# EAGLE design uc_ctrl (EAGLE 6.5.0)
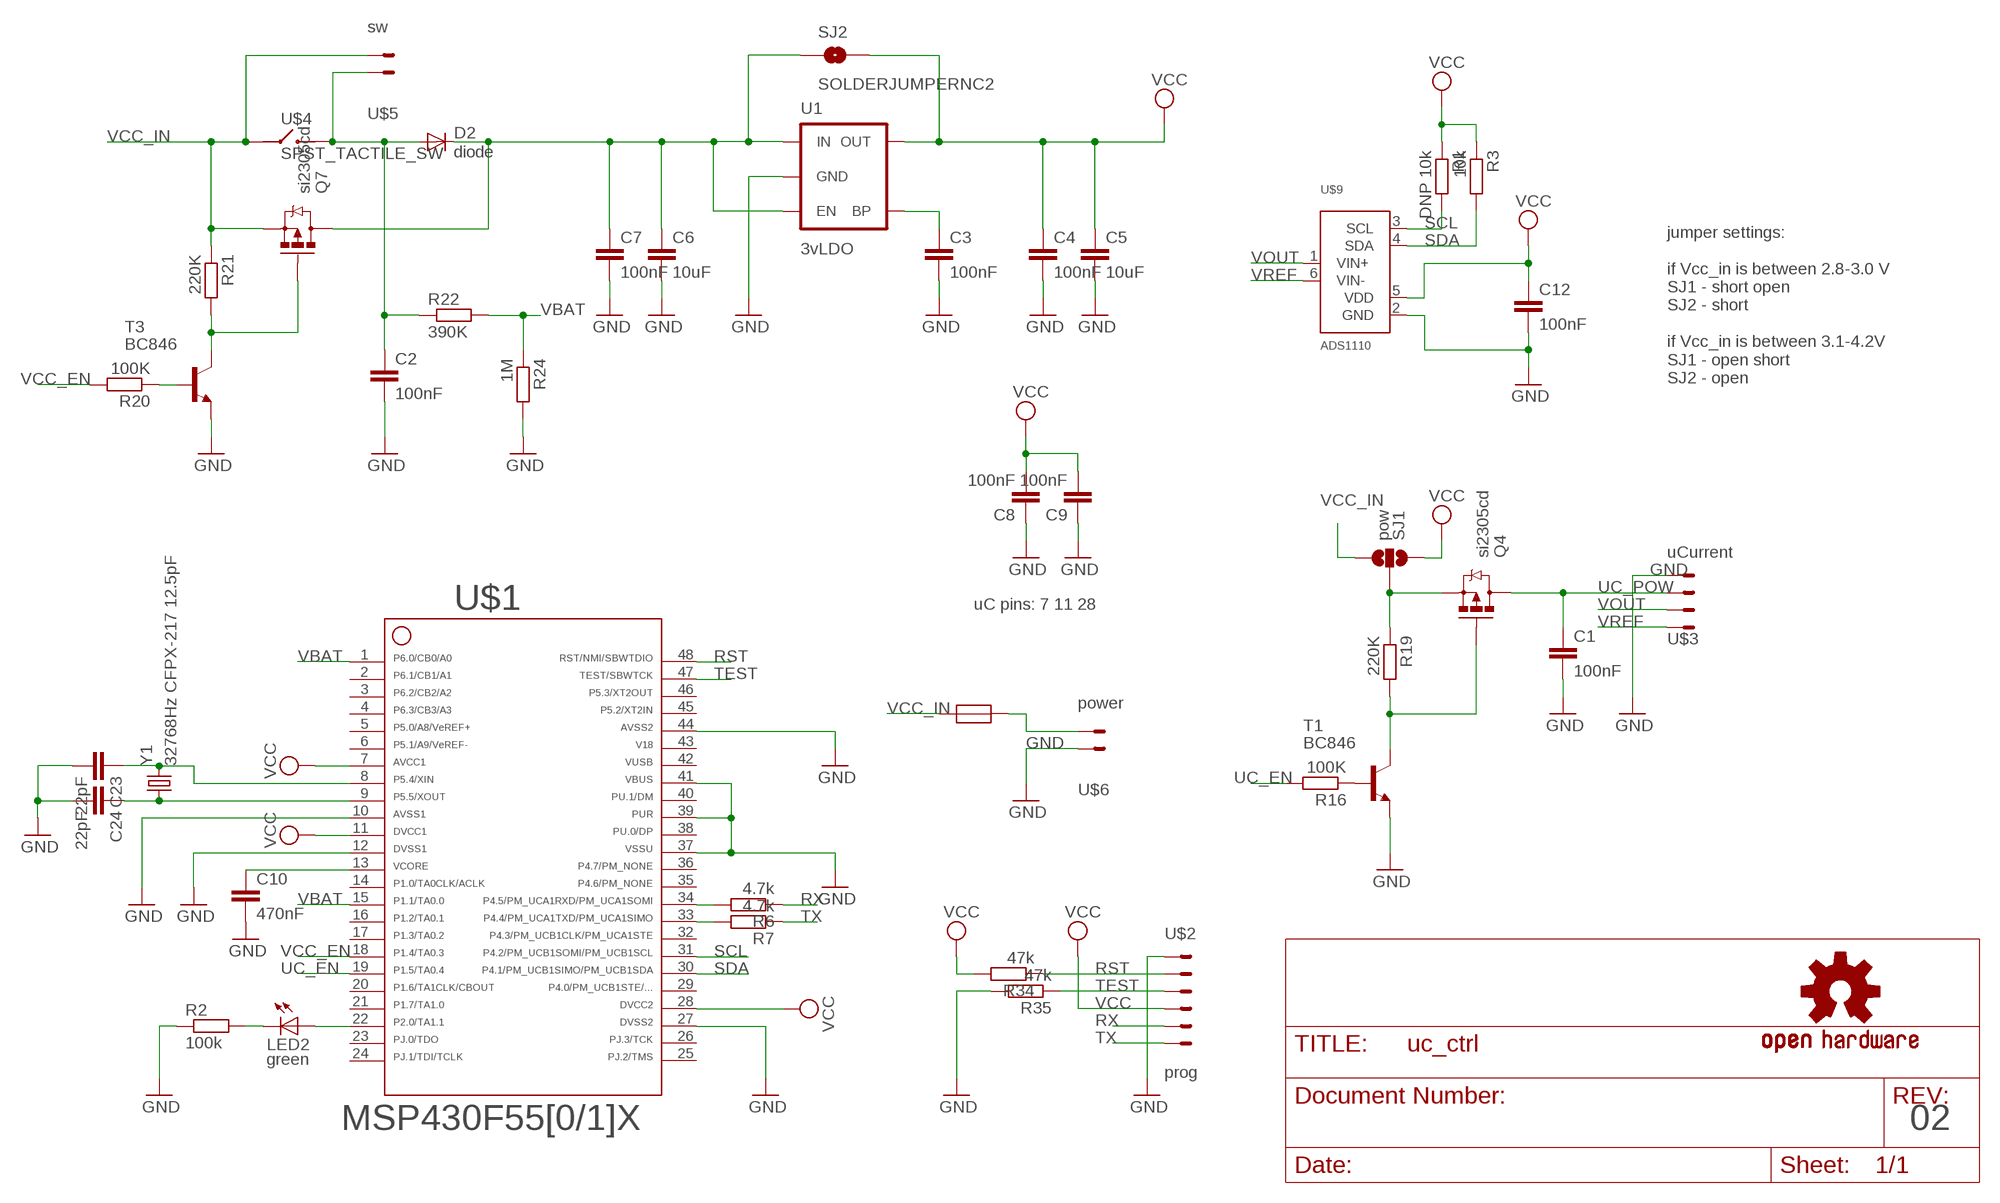
[diagram p0: schematic, sheet 1]

## Parts
C1  100nF  C-EUC0805  [C0805]
C2  100nF  C-EUC0805  [C0805]
C3  100nF  C-EUC0805  [C0805]
C4  100nF  C-EUC0805  [C0805]
C5  10uF  C-EUC0805  [C0805]
C6  10uF  C-EUC0805  [C0805]
C7  100nF  C-EUC0805  [C0805]
C8  100nF  C-EUC0805  [C0805]
C9  100nF  C-EUC0805  [C0805]
C10  470nF  C-EUC0805  [C0805]
C12  100nF  C-EUC0805  [C0805]
C23  22pF  C-EUC0805  [C0805]
C24  22pF  C-EUC0805  [C0805]
D2  diode  DIODESMA  [SMA-DIODE]
LED2  green  LEDCHIPLED_0805  [CHIPLED_0805]
Q4  si2305cd  MOSFET-PCHANNELSMD_POWER  [SOT23-3_POWER]
Q7  si2305cd  MOSFET-PCHANNELSMD_POWER  [SOT23-3_POWER]
R1  DNP 10k  R-EU_R0805W  [R0805W]
R2  100k  R-EU_R0805W  [R0805W]
R3  10k  R-EU_R0805W  [R0805W]
R6  4.7k  R-EU_R0805W  [R0805W]
R7  4.7k  R-EU_R0805W  [R0805W]
R16  100K  R-EU_R0805W  [R0805W]
R19  220K  R-EU_R0805W  [R0805W]
R20  100K  R-EU_R0805W  [R0805W]
R21  220K  R-EU_R0805W  [R0805W]
R22  390K  R-EU_R0805W  [R0805W]
R24  1M  R-EU_R0805W  [R0805W]
R34  47k  R-EU_R0805W  [R0805W]
R35  47k  R-EU_R0805W  [R0805W]
SJ1  pow  SOLDERJUMPER_2WAYPASTE1&2  [SJ_3_PASTE1&2]
SJ2  SOLDERJUMPERNC2  [SJ_2S-NOTRACE]
T1  BC846  [SOT23]
T3  BC846  [SOT23]
U1  3vLDO  V_REG_LDOSMD  [SOT23-5]
U$1  F55[0/1]X---PT48  [PT48]
U$2  prog  MOLEX_6HORIZONTAL  [0530480610]
U$3  uCurrent  MOLEX_4HORIZONTAL  [0530480401]
U$4  SPST_TACTILE_SW  [6X3.5_TACTILE_SW]
U$5  sw  MOLEX_2HORIZONTAL  [0530480210]
U$6  power  MOLEX_2HORIZONTAL  [0530480210]
U$7  OSHW-LOGOM  [OSHW-LOGO-M]
U$8  RESETTABLE  [1210]
U$9  ADS1110  [SOT23-6]
Y1  32768Hz CFPX-217 12.5pF  CRYSTAL3.2X1.5  [CRYSTAL-SMD-3.2X1.5]

## Nets
GND: C1.2 C2.2 C3.2 C4.2 C5.2 C6.2 C7.2 C8.1 C9.1 C10.2 C12.2 C23.2 C24.2 R2.1 R24.2 R35.2 T1.2(E) T3.2(E) U1.2(GND) U$1.10 U$1.12 U$1.27 U$1.37 U$1.39 U$1.41 U$1.44 U$2.1 U$3.1 U$6.P$1 U$9.2(GND)
N$1: LED2.C R2.2
N$2: LED2.A U$1.22
N$3: R16.1 T1.1(B)
N$4: C6.1 C7.1 D2.C Q7.3(D) SJ2.1 U1.1(IN) U1.3(EN)
N$5: C3.1 U1.4(BP)
N$6: C10.1 U$1.13
N$8: Q4.2(S) R19.1 SJ1.2
N$9: U$6.P$2 U$8.P$2
N$11: R6.2 U$1.34
N$13: R7.2 U$1.33
N$25: C24.1 U$1.9 Y1.P$1
N$26: C23.1 U$1.8 Y1.P$2
N$28: Q4.1(G) R19.2 T1.3(C)
N$31: R20.1 T3.1(B)
N$32: Q7.1(G) R21.2 T3.3(C)
PUSH: C2.1 D2.A R22.1 U$4.2 U$5.P$1
RST: R34.1 U$1.48 U$2.2
RX: R6.1 U$2.5
SCL: R1.2 U$1.31 U$9.3(SCL)
SDA: R3.2 U$1.30 U$9.4(SDA)
TEST: R35.1 U$1.47 U$2.3
TX: R7.1 U$2.6
UC_EN: R16.2 U$1.19
UC_POW: C1.1 Q4.3(D) U$3.2
VBAT: R22.2 R24.1 U$1.1 U$1.15
VCC: C4.1 C5.1 C8.2 C9.2 C12.1 R1.1 R3.1 R34.2 SJ1.1 SJ2.2 U1.5(OUT) U$1.7 U$1.11 U$1.28 U$2.4 U$9.5(VDD)
VCC_EN: R20.2 U$1.18
VCC_IN: Q7.2(S) R21.1 SJ1.3 U$4.1 U$5.P$2 U$8.P$1
VOUT: U$3.3 U$9.1(VIN+)
VREF: U$3.4 U$9.6(VIN-)
Unconnected: U$1.2 U$1.3 U$1.4 U$1.5 U$1.6 U$1.14 U$1.16 U$1.17 U$1.20 U$1.21 U$1.23 U$1.24 U$1.25 U$1.26 U$1.29 U$1.32 U$1.35 U$1.36 U$1.38 U$1.40 U$1.45

## Notes on the sheet
- jumper settings:
  
  if Vcc_in is between 2.8-3.0 V
  SJ1 - short open
  SJ2 - short
  
  if Vcc_in is between 3.1-4.2V
  SJ1 - open short
  SJ2 - open
- uC pins: 7 11 28
- 02

## Power pins joined to a net without a drawn wire
42: U$1.42
43: U$1.43
46: U$1.46

## Library data of the parts
C1-C10 C12 C23 C24 = rcl:C-EU: CAPACITOR, European symbol
D2 = SparkFun-DiscreteSemi:DIODE: Diode These are standard reverse protection diodes and small signal diodes. SMA package can handle up to about 1A. SOD-323 can handle about 200mA. What the SOD-323 package when ordering, there are some mfgs out there that are 5-pin packages.
LED2 = led:LED: LED OSRAM: - CHIPLED LG R971, LG N971, LY N971, LG Q971, LY Q971, LO R971, LY R971 LH N974, LH R974 LS Q976, LO Q976, LY Q976 LO Q996 - Hyper CHIPLED LW Q18S LB Q993, LB Q99A, LB R99A - SideLED LS A670, LO A670, LY A670, LG A670, LP A670 LB A673, LV A673, LT A673, LW A673 LH A674 LY A675 LS A676, LA A676, LO A676, LY A676, LW A676 LS A679, LY A679, LG A679 - Hyper Micro SIDELED® LS Y876, LA Y876, LO Y876, LY Y876 LT Y87S - SmartLED LW L88C, LW L88S LB L89C, LB L89S, LG L890 LS L89K, LO L89K, LY L89K LS L896, LA L896, LO L896, LY L896 - TOPLED LS T670, LO T670, LY T670, LG T670, LP T670 LSG T670, LSP T670, LSY T670, LOP T670, LYG T670 LG T671, LOG T671, LSG T671 LB T673, LV T673, LT T673, LW T673 LH T674 LS T676, LA T676, LO T676, LY T676, LB T676, LH T676, LSB T676, LW T676 LB T67C, LV T67C, LT T67C, LS T67K, LO T67K, LY T67K, LW E67C LS E67B, LA E67B, LO E67B, LY E67B, LB E67C, LV E67C, LT E67C LW T67C LS T679, LY T679, LG T679 LS T770, LO T770, LY T770, LG T770, LP T770 LB T773, LV T773, LT T773, LW T773 LH T774 LS E675, LA E675, LY E675, LS T675 LS T776, LA T776, LO T776, LY T776, LB T776 LHGB T686 LT T68C, LB T68C - Hyper Mini TOPLED® LB M676 - Mini TOPLED Santana® LG M470 LS M47K, LO M47K, LY M47K Source: http://www.osram.convergy.de LUXEON: - LUMILED® LXK2-PW12-R00, LXK2-PW12-S00, LXK2-PW14-U00, LXK2-PW14-V00 LXK2-PM12-R00, LXK2-PM12-S00, LXK2-PM14-U00 LXK2-PE12-Q00, LXK2-PE12-R00, LXK2-PE12-S00, LXK2-PE14-T00, LXK2-PE14-U00 LXK2-PB12-K00, LXK2-PB12-L00, LXK2-PB12-M00, LXK2-PB14-N00, LXK2-PB14-P00, LXK2-PB14-Q00 LXK2-PR12-L00, LXK2-PR12-M00, LXK2-PR14-Q00, LXK2-PR14-R00 LXK2-PD12-Q00, LXK2-PD12-R00, LXK2-PD12-S00 LXK2-PH12-R00, LXK2-PH12-S00 LXK2-PL12-P00, LXK2-PL12-Q00, LXK2-PL12-R00 Source: www.luxeon.com KINGBRIGHT: KA-3528ASYC Source: www.kingbright.com
Q4 Q7 = Simplex-DiscreteSemi:MOSFET-PCHANNEL: Generic PMOSFET
R1-R3 R6 R7 R16 R19-R22 R24 R34 R35 = rcl:R-EU_: RESISTOR, European symbol
SJ1 = SparkFun-Passives:SOLDERJUMPER_2WAY: Solder Jumper 2 way solder jumper
SJ2 = SparkFun-Passives:SOLDERJUMPER: Solder Jumper Standard SMD solder jumper. Used to automate production. Two varients : Normally Open and Normally Closed are the same, but have different paste layers. NC will have a large amount of paste and should jumper during reflow.
T1 T3 = transistor:BC846: NPN TRANSISTOR
U1 = SparkFun-PowerIC:V_REG_LDO: Voltage Regulator LDO Standard 150mA LDO voltage regulator in SOT-23 layout. Micrel part MIC5205. BP (by-pass) pin is used to lower output noise with 470pF cap.
U$1 = TI_MSP430_v16:F55[0/1]X---PT48: ***F55[0/1/2]X*** PT48 Rev. 1.0 06/2010 "http://www.ti.com/lit/gpn/msp430f5509" Only for FF5504, F5508,F5509,F5510
U$2 = Simplex-Connectors:MOLEX_6: Molex 6 pin connectors 1.25mm PicoBlade
U$3 = Simplex-Connectors:MOLEX_4: Molex 4 pin connectors 1.25mm PicoBlade
U$4 = Simplex-Switches:SPST_TACTILE_SW: SPST tactile switches
U$5 U$6 = Simplex-Connectors:MOLEX_2: Molex 2 pin connectors 1.25mm PicoBlade
U$7 = SparkFun:OSHW-LOGO: Open Source Hardware Logo This logo indicates the piece of hardware it is found on incorporates a OSHW license and/or adheres to the definition of open source hardware found here: http://freedomdefined.org/OSHW
U$8 = Simplex-Fuses:RESETTABLE
U$9 = Simplex-ICs:ADS1110: TI ADS1110
Y1 = Simplex-FreqCtrl:CRYSTAL: smd crystals

## Net classes
1 vcc: width 0.203 mm

## Board
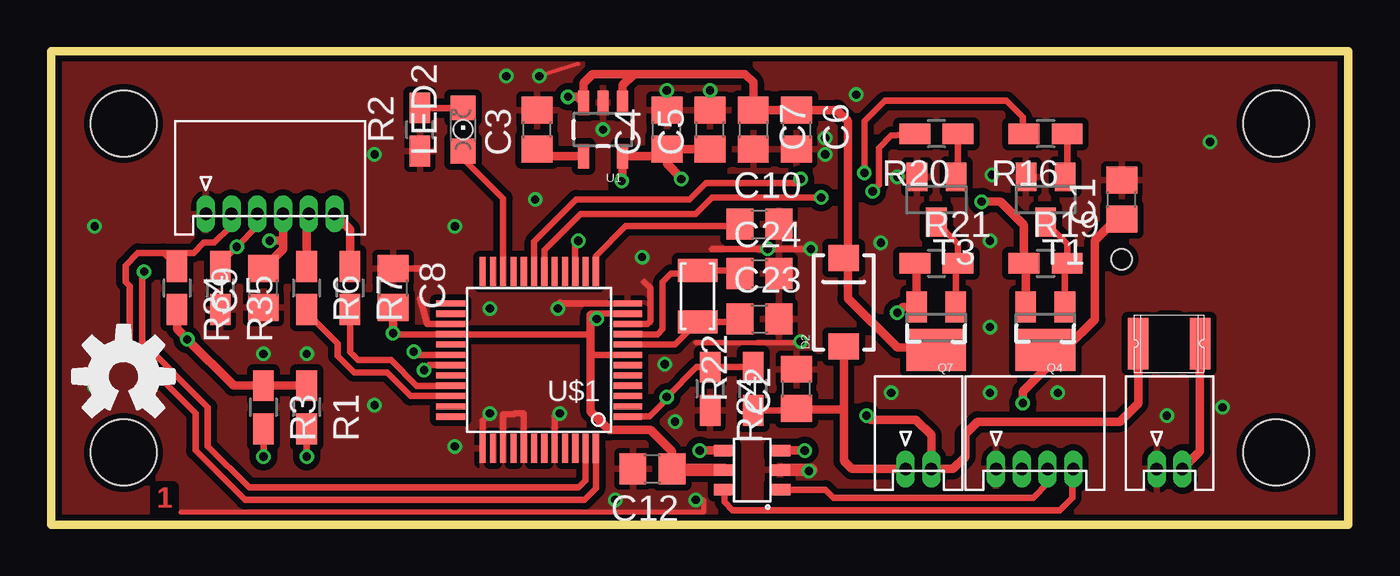
[diagram p1: board, top side]
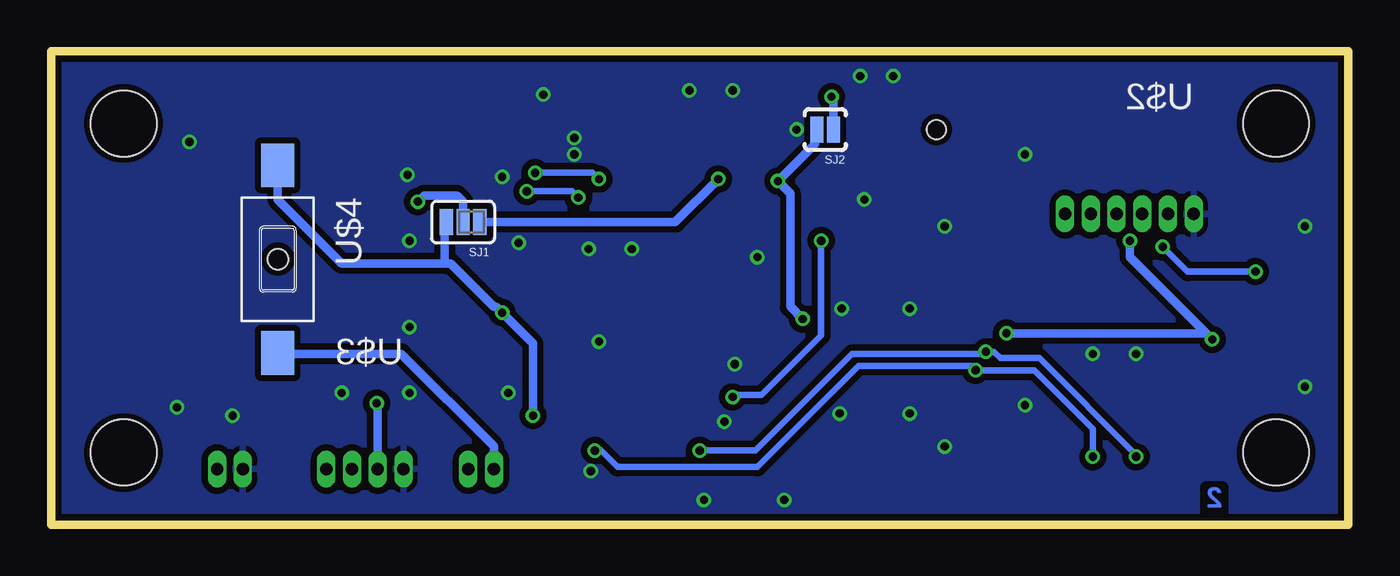
[diagram p2: board, bottom side, seen from below]

Size 63 x 23 mm. Coordinates in mm from the lower left corner, seen from the top.
Outline: 0,0 63,0 63,23 0,23 0,0
Copper layers (1*16): Top 0.035mm / dielectric 1.5mm / Bottom 0.035mm
Design rules "seeedstudio_rules_v1.1 *": minimum track width 6mil, minimum drill 12mil, track to track 6mil, track to pad 6mil, pad to pad 6mil, via to via 6mil, smd to smd 0mil, copper to edge 10mil, drill to drill 10mil, minimum pad ring 0.154mm, minimum via ring 6mil, stop-mask expansion 2mil, vias tented up to drill 100mil, thermal gap 10mil
Holes 3.2 mm at 59.5,3.5 3.5,3.5 59.5,19.5 3.5,19.5
Holes 0.9 mm at 20,19.2
Holes 1 mm at 52,12.9
tRestrict: 5 lines

### Footprints (pad centres in the part's own frame; a part is rotated, then mirrored left to right if it is on the bottom)
C0805 = smd 1.3 x 1.5: 1 -0.95,0; 2 0.95,0
SMA-DIODE = smd 1.27 x 1.47: A -2.15,0; C 2.15,0
CHIPLED_0805 = smd 1.2 x 1.2: A 0,-1.05; C 0,1.05
SOT23-3_POWER = smd 1 x 1.5: 1 -0.939,-1.384; 2 0.961,-1.384 | smd 2.9 x 2.05: 3 0.011,0.716
R0805W = smd 1.5 x 1: 1 -1.052,0; 2 1.052,0
SJ_3_PASTE1&2 = smd 0.635 x 1.27: 1 -0.813,0; 2 0,0; 3 0.813,0
SJ_2S-NOTRACE = smd 0.635 x 1.27: 1 -0.401,0; 2 0.413,0
SOT23 = smd 1 x 1.4: 1 -0.95,-1.1; 2 0.95,-1.1; 3 0,1.1
SOT23-5 = smd 0.55 x 1.2: 1 -0.95,-1.3; 2 0,-1.3; 3 0.95,-1.3; 4 0.95,1.3; 5 -0.95,1.3
PT48 = smd 1.4 x 0.3: 1 -4.3,2.75; 2 -4.3,2.25; 3 -4.3,1.75; 4 -4.3,1.25; 5 -4.3,0.75; 6 -4.3,0.25; 7 -4.3,-0.25; 8 -4.3,-0.75; 9 -4.3,-1.25; 10 -4.3,-1.75; 11 -4.3,-2.25; 12 -4.3,-2.75; 25 4.3,-2.75; 26 4.3,-2.25; 27 4.3,-1.75; 28 4.3,-1.25; 29 4.3,-0.75; 30 4.3,-0.25; 31 4.3,0.25; 32 4.3,0.75; 33 4.3,1.25; 34 4.3,1.75; 35 4.3,2.25; 36 4.3,2.75 | smd 0.3 x 1.4: 13 -2.75,-4.3; 14 -2.25,-4.3; 15 -1.75,-4.3; 16 -1.25,-4.3; 17 -0.75,-4.3; 18 -0.25,-4.3; 19 0.25,-4.3; 20 0.75,-4.3; 21 1.25,-4.3; 22 1.75,-4.3; 23 2.25,-4.3; 24 2.75,-4.3; 37 2.75,4.3; 38 2.25,4.3; 39 1.75,4.3; 40 1.25,4.3; 41 0.75,4.3; 42 0.25,4.3; 43 -0.25,4.3; 44 -0.75,4.3; 45 -1.25,4.3; 46 -1.75,4.3; 47 -2.25,4.3; 48 -2.75,4.3
0530480610 = drill 0.6 pad 0.9 long: 1 0,0; 2 1.25,0; 3 2.5,0; 4 3.75,0; 5 5,0; 6 6.25,0
0530480401 = drill 0.6 pad 0.9 long: 1 0,0; 2 1.25,0; 3 2.5,0; 4 3.75,0
6X3.5_TACTILE_SW = smd 2.12 x 1.6: 1 -4.56,0; 2 4.56,0
0530480210 = drill 0.6 pad 0.9 long: P$1 0,0; P$2 1.25,0
1210 = smd 1 x 2.5: P$1 -1.5,0; P$2 1.5,0
SOT23-6 = smd 0.55 x 1: 1 0,0; 2 0.95,0; 3 1.9,0; 4 1.9,2.7; 5 0.95,2.7; 6 0,2.7
CRYSTAL-SMD-3.2X1.5 = smd 1.1 x 1.9: P$1 -1.25,0; P$2 1.25,0

### Placement (x,y rotation side)
C1  52,15.8 90 top
C2  36.2,6.6 90 top
C3  23.6,19.2 90 top
C4  29.9,19.2 90 top
C5  32,19.2 90 top
C6  36.2,19.2 270 top
C7  34.1,19.2 270 top
C8  16.6,11.5 270 top
C9  10.3,11.5 90 top
C10  34.4,14.6 0 top
C12  29.2,2.7 180 top
C23  34.4,10 0 top
C24  34.4,12.2 0 top
D2  38.5,10.8 90 top
LED2  20,19.2 0 top
Q4  48.3,9.2 180 top
Q7  43,9.2 180 top
R1  12.4,5.7 270 top
R2  17.9,19.2 90 top
R3  10.3,5.7 270 top
R6  12.4,11.5 270 top
R7  14.5,11.5 270 top
R16  48.3,19 180 top
R19  48.3,12.7 0 top
R20  43,19 180 top
R21  43,12.7 0 top
R22  34.1,6.6 90 top
R24  32,6.6 270 top
R34  6.1,11.5 270 top
R35  8.2,11.5 270 top
SJ1  43,14.7 180 bottom
SJ2  25.4,19.2 180 bottom
T1  48.3,15.8 180 top
T3  43,15.8 180 top
U1  26.8,19.2 180 top
U$1  23.7,8 180 top
U$2  7.5,15.1 0 top
U$3  45.9,2.7 0 top
U$4  52,12.9 270 bottom
U$5  41.5,2.7 0 top
U$6  53.7,2.7 0 top
U$7  3.5,7.2 0 top
U$8  54.3,8.8 0 top
U$9  35.4,1.7 90 top
Y1  31.4,11.1 270 top

### Tracks (layer width: path | path; a pad name or v marks a point on that pad's centre or on a via)
GND  (via drill 0.4)
  Top 0.19: 25.6,22.4 v23.7,21.8
  Top 0.254: 6.3,0.6 31.7,0.6 31.7,1.2 v31.3,1.2 | 31.3,8.85 36.4,8.85
  Top 0.305: U$1.12 24.75,10.75 24.7,10.8 | U$1.27 18.25,9.75 17.9,11 | 17.9,12.45 C8.1 | U$1.37 20.95,5.05 v21.3,5.4 | U$1.44 24.45,5.25 24.6,5.4 v24.7,5.4 | U$1.10 28.95,9.75 29.1,9.9 29.1,11.5 28.8,11.8 | 32.1,13.4 v36.9,13.4 | U$1.41 22.95,5.4 22.5,5.4 22.45,5.35 21.95,5.35 U$1.39
  Top 0.61: U$9.2 36.9,2.66 | U$9.2 36.8,2.65 v36.8,2.6
  other vias: 10.3,8.3 15.7,5.8 12.4,8.3 34.8,13.4 36.4,8.9 21.3,10.5 24.6,10.5 29.9,21.1 32,21.1 26.8,19.2 19.6,14.5 37.6,18.8 37.6,18 41.1,16.9 40.3,13.7 45.7,17 45.6,6.4 48.9,6.4 23.5,15.8 2.1,14.5 2.1,6.7 40.8,6.4 45.6,9.6 45.6,13.8 22.1,21.8 56.3,18.6 54.2,5.3 39.1,20.9 28.7,13 30.3,5 27.4,1.2 56.9,5.7 29.8,7.8 15.7,18 19.6,3.8
  pour Top (isolate 0.305): 0,23 0,0 63,0 63,23
  pour Bottom (isolate 0.305): 0,23 0,0 63,0 63,23
N$1
  Top 0.305: R2.2 18.9,20.25 LED2.C
N$2
  Top 0.305: U$1.22 21.95,15.85 20,17.8 LED2.A
N$3
  Top 0.305: R16.1 49.35,17.1 T1.1
N$4  (via drill 0.4)
  Top 0.406: U1.1 27.75,21.35 28.3,21.9 | 28.3,21.9 33.7,21.9 34.1,21.5 C7.1 C6.1 38.15,20.15 38.7,19.6 38.7,12.6 | 28.3,21.9 26.3,21.9 25.85,21.45 U1.3 25.55,20.8 v25.1,20.8 | 38.7,12.6 38.7,11 41.1,8.6 42.87,8.6 Q7.3 | D2.C 38.5,12.8 38.7,12.6
  Bottom 0.406: v25.1,20.8 v25.1,20.8 arc90 25,20.7 SJ2.1
N$5
  Top 0.406: C3.1 23.95,17.9 U1.4
N$6
  Top 0.305: U$1.13 26.45,13.05 27.9,14.5 33.35,14.5 arc90 C10.1
N$8  (via drill 0.4)
  Top 0.305: R19.1 47.34,12.71
  Top 0.406: 47.34,12.71 Q4.2 | R19.1 47.25,14.55 46.1,15.7 v45.2,15.7
  Bottom 0.406: SJ1.2 43,15.7 43.3,16 44.9,16 v45.2,15.7
N$9
  Top 0.406: U$6.P$2 55.8,3.55 U$8.P$2
N$11
  Top 0.305: U$1.34 17.45,6.25 16.3,7.4 14.7,7.4 13.9,8.2 13.9,8.8 12.4,10.3 R6.2
N$13
  Top 0.305: R7.2 14.5,8.4 14.9,8 16.5,8 17.75,6.75 U$1.33
N$25
  Top 0.305: C24.1 33.3,12.35 Y1.P$1 arc-90 31.05,12 30.9,12 30.7,12.2 30.1,12.2 29.7,11.8 29.7,9.5 29.45,9.25 U$1.9
N$26
  Top 0.305: C23.1 33.3,9.85 Y1.P$2 30.3,8.75 U$1.8
N$28
  Top 0.305: Q4.1 49.24,12.69 R19.2 49.35,13.65 T1.3
N$31
  Top 0.305: R20.1 44.05,17 T3.1
N$32
  Top 0.305: T3.3 44.05,13.65 R21.2 43.94,12.59 Q7.1
PUSH
  Top 0.305: R22.1 36,5.55 C2.1
  Top 0.406: U$5.P$1 38.9,2.7 38.5,3.1 38.5,5.6 | 38.5,5.6 D2.A | C2.1 36.15,5.6 38.5,5.6
  Bottom 0.406: U$4.2 51.96,8.3 46,8.3 41.5,3.8 U$5.P$1
RST
  Top 0.305: 5.45,13.2 4.2,13.2 3.6,12.6 3.6,11.8 3.8,11.6 3.8,8.6 7,5.4 7,3.6 9.4,1.2 25.9,1.2 26.45,1.75 U$1.48 | 5.45,13.2 R34.1 | U$2.2 8.75,14.45 8.65,14.45 7.9,13.7 7.4,13.7 6.9,13.2 5.45,13.2
RX
  Top 0.406: R6.1 12.4,15 U$2.5
SCL  (via drill 0.4)
  Top 0.305: U$1.31 18.35,7.75 v18.1,7.5 | R1.2 v12.4,3.3
  Top 0.406: U$9.3 v36.6,3.6
  Bottom 0.305: v36.6,3.6 36.3,3.6 35.5,2.8 28.7,2.8 23.8,7.7 18.3,7.7 v18.1,7.5 15.25,7.5 R1.2 v12.4,3.3
SDA  (via drill 0.4)
  Top 0.305: U$1.30 17.75,8.25 v17.6,8.4 | R3.2 v10.3,3.3
  Top 0.406: U$9.4 v31.5,3.6
  Bottom 0.305: v31.5,3.6 28.8,3.6 24.1,8.3 17.8,8.3 17.7,8.4 v17.6,8.4 17.2,8.4 16.9,8.1 15,8.1 10.3,3.4 v10.3,3.3
TEST  (via drill 0.4)
  Top 0.305: U$1.47 25.95,2.15 25.6,1.8 9.6,1.8 7.6,3.8 7.6,5.7 4.4,8.9 4.4,12.3 | 4.4,12.3 4.4,12.4 | v4.5,12.3 4.4,12.3 | U$2.3 10,14.5 v9,13.5 8.2,12.7 R35.1
  Bottom 0.305: v4.5,12.3 7.8,12.3 v9,13.5
TX
  Top 0.406: R7.1 14.5,14.35 U$2.6
UC_EN  (via drill 0.4)
  Top 0.305: U$1.19 23.45,13.75 25.5,15.8 31,15.8 31.8,16.6 36.2,16.6 v36.4,16.8 | R16.2 47.2,19.05 47.2,19.8 46.4,20.6 40.5,20.6 39.5,19.6 v39.5,17.1
  Bottom 0.305: v36.4,16.8 36.7,17.1 v39.5,17.1
UC_POW  (via drill 0.4)
  Top 0.406: Q4.3 arc-90 48.75,8.02 | 48.75,8.02 arc-90 49.28,8.55 50.7,9.97 50.7,13.8 51.75,14.85 C1.1 | 48.75,8.02 47.2,6.47 v47.2,5.9
  Bottom 0.406: 47.25,5.85 arc90 v47.2,5.9 47.15,5.85 U$3.2
VBAT  (via drill 0.4)
  Top 0.305: U$1.15 25.45,13.65 v25.6,13.8 | U$1.1 29.05,5.25 29.9,6.1 v29.9,6.2 31.35,7.65 R24.1 R22.2
  Bottom 0.305: v25.6,13.8 25.6,9.2 28.5,6.3 29.8,6.3 v29.9,6.2
VCC  (via drill 0.4)
  Top 0.305: 26.2,9.25 U$1.28 16.65,9.25 arc-90 v16.6,9.3 | 26.2,10.2 26.25,10.25 | 26.25,10.25 U$1.11 | U$1.7 26.2,8.25 | 26.25,10.25 v26.5,10 | 30.2,2.65 C12.1
  Top 0.406: C9.2 11.25,13.4 11.25,13.8 | R34.2 6.1,9.5 v6.6,9 8.85,6.75 R1.1 R3.1 | 26.2,10.2 26.2,9.25 26.2,8.25 26.2,5.5 27.1,4.6 29.1,4.6 30.15,3.55 C12.1 | C5.1 C4.1 | C4.1 29.55,17.9 U1.5 27.75,16.85 27.7,16.8 v27.7,16.7 | v30.6,16.8 30.6,16.85 29.9,17.55 C4.1 | 11.25,13.8 U$2.4 | v10.6,13.8 11.25,13.8 | C8.2 v16.6,9.3
  Top 0.61: U$9.5 30.2,2.65
  Bottom 0.406: 15.1,9.3 v16.6,9.3 6.9,9.3 v6.6,9 10.6,13 v10.6,13.8 | v26.5,10 27.1,10.6 27.1,16.1 v27.7,16.7 25.91,18.49 25.91,19.1 arc90 SJ2.2 | v30.6,16.8 32.7,14.7 SJ1.1
VCC_EN  (via drill 0.4)
  Top 0.305: U$1.18 23.95,13.35 25.7,15.1 31.3,15.1 32.1,15.9 v37.4,15.9 | R20.2 40.8,18.9 40.2,18.3 40.2,16.5 v39.9,16.2
  Bottom 0.305: v37.4,15.9 37.7,16.2 v39.9,16.2
VCC_IN  (via drill 0.4)
  Top 0.305: R21.1 42.04,12.61
  Top 0.406: 42.04,12.61 Q7.2 41.38,10.58 v41.1,10.3 | v39.6,5.3 39.8,5.1 42,5.1 42.75,4.35 U$5.P$2 43.8,2.7 44.4,3.3 44.4,4.4 45,5 51.9,5 52.8,5.9 U$8.P$1
  Bottom 0.406: 43.9,12.7 48.9,12.7 52,15.8 U$4.1 | SJ1.3 43.9,14.61 43.9,12.7 | 43.9,12.7 43.62,12.7 41.5,10.58 41.38,10.58 v41.1,10.3 39.6,8.8 v39.6,5.3
VOUT
  Top 0.305: U$9.1 37.6,1.7 38,1.3 47.7,1.3 48.4,2 U$3.3
VREF
  Top 0.305: U$9.6 32.7,1.1 33.1,0.7 49,0.7 49.6,1.3 49.6,2.65 U$3.4

### Text on the board
Top: 1
Bottom: 2
tmine: http://github.com/rodan/ucurrent_ctrl | debug | gnd | rst | test | vcc | rx | tx | rev 2.0 201312 | uCurrent | VBAT- out | VBAT+ out | Vout+ in | Vout- in | battery | gnd | Vcc_in | ext_sw | uCurrent | battery
bmine: SJ2 | if Vcc_in is between 2.8-3.0 V / SJ1 - short open / SJ2 - short / / if Vcc_in is between 3.1-4.2V / SJ1 - open short / SJ2 - open | SJ1